# Altium project uMultimeter.PrjPCB
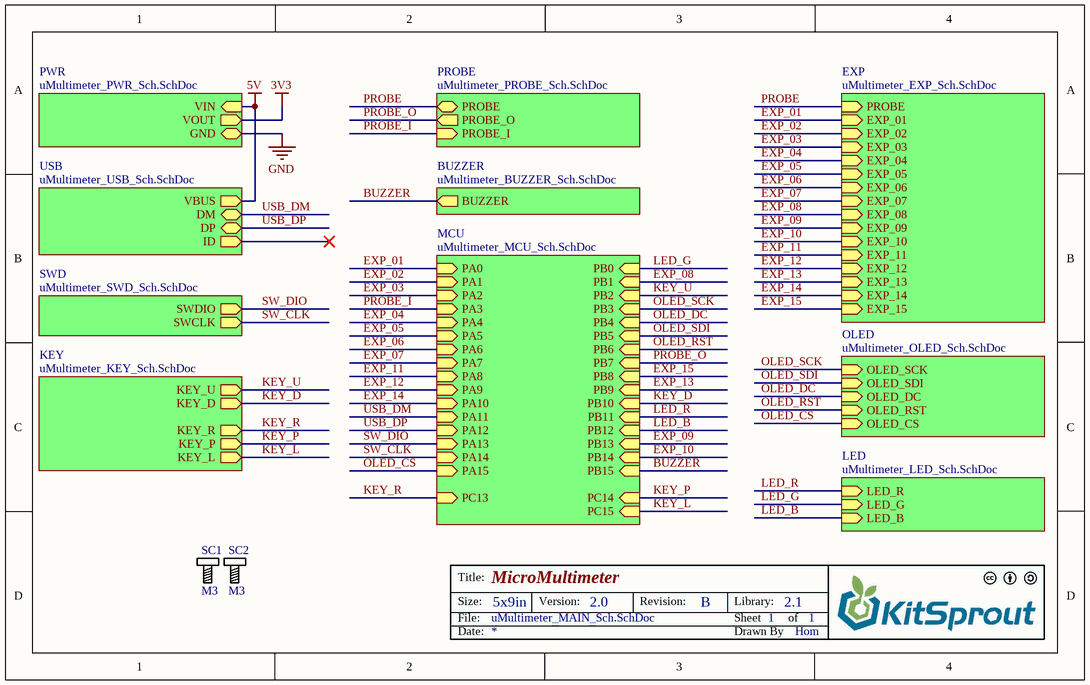
[diagram p0: uMultimeter_MAIN_Sch.SchDoc]
11 sheets, 55 parts. Net scope: hierarchical (ports join the sheet entries above them; power ports are global).
Board file: uMultimeter__Pcb.PcbDoc
Sheets:
  uMultimeter_MAIN_Sch.SchDoc
    PWR = uMultimeter_PWR_Sch.SchDoc
    SWD = uMultimeter_SWD_Sch.SchDoc
    KEY = uMultimeter_KEY_Sch.SchDoc
    USB = uMultimeter_USB_Sch.SchDoc
    LED = uMultimeter_LED_Sch.SchDoc
    PROBE = uMultimeter_PROBE_Sch.SchDoc
    BUZZER = uMultimeter_BUZZER_Sch.SchDoc
    OLED = uMultimeter_OLED_Sch.SchDoc
    EXP = uMultimeter_EXP_Sch.SchDoc
    MCU = uMultimeter_MCU_Sch.SchDoc

## Sheet uMultimeter_MAIN_Sch.SchDoc: MicroMultimeter
size 203 x 127 mm; Author: Hom; CompanyName: KitSprout; DrawnBy: Hom; Engineer: Hom; Organization: KitSprout; Revision: B; SheetNumber: 1; SheetTotal: 1; License: CC BY-SA 4.0; Version: 2.0; LibVersion: 2.1; PageSetup: Record=PageOptions|CenterHorizontal=True|CenterVertical=True|PrintScale=1.00|XCorrection=1.00|YCorrection=1.00|PrintKind=0|BorderSize=5000000|LeftOffset=0|BottomOffset=0|Orientation=2|PaperLength=1000|PaperWidth=1000|Scale=100|PaperSource=7|PrintQuality=-3|MediaType=1|DitherType=10|PrintScaleMode=0|PaperKind=A4|PaperIndex=9

### Parts
SC1  M3  [SCRREW_M3]
SC2  M3  [SCRREW_M3]

### Sub-sheets
BUZZER = uMultimeter_BUZZER_Sch.SchDoc: BUZZER (out)
EXP = uMultimeter_EXP_Sch.SchDoc: PROBE (in), EXP_01 (in), EXP_02 (in), EXP_03 (in), EXP_04 (in), EXP_05 (in), EXP_06 (in), EXP_07 (in), EXP_08 (in), EXP_09 (in), EXP_10 (in), EXP_11 (in), EXP_12 (in), EXP_13 (in), EXP_14 (in), EXP_15 (in)
KEY = uMultimeter_KEY_Sch.SchDoc: KEY_D (out), KEY_U (out), KEY_P (out), KEY_R (out), KEY_L (out)
LED = uMultimeter_LED_Sch.SchDoc: LED_G (in), LED_R (in), LED_B (in)
MCU = uMultimeter_MCU_Sch.SchDoc: PA0 (in), PA1 (in), PA2 (in), PA3 (in), PA4 (in), PA5 (in), PA6 (in), PA7 (in), PA8 (in), PA9 (in), PA10 (in), PA11 (in), PA12 (in), PA13 (in), PA14 (in), PA15 (in), PB0 (in), PB1 (in), PB2 (in), PB3 (in), PB4 (in), PB5 (in), PB6 (in), PB7 (in), PB8 (in), PB9 (in), PB10 (in), PB11 (in), PB12 (in), PB13 (in), PB14 (in), PB15 (in), PC13 (in), PC14 (in), PC15 (in)
OLED = uMultimeter_OLED_Sch.SchDoc: OLED_SDI (in), OLED_SCK (in), OLED_DC (in), OLED_RST (in), OLED_CS (in)
PROBE = uMultimeter_PROBE_Sch.SchDoc: PROBE (bidir), PROBE_I (in), PROBE_O (out)
PWR = uMultimeter_PWR_Sch.SchDoc: VOUT (out), VIN (in), GND (bidir)
SWD = uMultimeter_SWD_Sch.SchDoc: SWDIO (out), SWCLK (out)
USB = uMultimeter_USB_Sch.SchDoc: DM (bidir), VBUS (out), DP (bidir), ID (out)

### Nets
5V: sheet PWR/VIN, sheet USB/VBUS
BUZZER: sheet BUZZER/BUZZER, sheet MCU/PB15
EXP_01: sheet EXP/EXP_01, sheet MCU/PA0
EXP_02: sheet EXP/EXP_02, sheet MCU/PA1
EXP_03: sheet EXP/EXP_03, sheet MCU/PA2
EXP_04: sheet EXP/EXP_04, sheet MCU/PA4
EXP_05: sheet EXP/EXP_05, sheet MCU/PA5
EXP_06: sheet EXP/EXP_06, sheet MCU/PA6
EXP_07: sheet EXP/EXP_07, sheet MCU/PA7
EXP_08: sheet EXP/EXP_08, sheet MCU/PB1
EXP_09: sheet EXP/EXP_09, sheet MCU/PB13
EXP_10: sheet EXP/EXP_10, sheet MCU/PB14
EXP_11: sheet EXP/EXP_11, sheet MCU/PA8
EXP_12: sheet EXP/EXP_12, sheet MCU/PA9
EXP_13: sheet EXP/EXP_13, sheet MCU/PB9
EXP_14: sheet EXP/EXP_14, sheet MCU/PA10
EXP_15: sheet EXP/EXP_15, sheet MCU/PB8
KEY_D: sheet KEY/KEY_D, sheet MCU/PB10
KEY_L: sheet KEY/KEY_L, sheet MCU/PC15
KEY_P: sheet KEY/KEY_P, sheet MCU/PC14
KEY_R: sheet KEY/KEY_R, sheet MCU/PC13
KEY_U: sheet KEY/KEY_U, sheet MCU/PB2
LED_B: sheet LED/LED_B, sheet MCU/PB12
LED_G: sheet LED/LED_G, sheet MCU/PB0
LED_R: sheet LED/LED_R, sheet MCU/PB11
OLED_CS: sheet OLED/OLED_CS, sheet MCU/PA15
OLED_DC: sheet OLED/OLED_DC, sheet MCU/PB4
OLED_RST: sheet OLED/OLED_RST, sheet MCU/PB6
OLED_SCK: sheet OLED/OLED_SCK, sheet MCU/PB3
OLED_SDI: sheet OLED/OLED_SDI, sheet MCU/PB5
PROBE: sheet PROBE/PROBE, sheet EXP/PROBE
PROBE_I: sheet PROBE/PROBE_I, sheet MCU/PA3
PROBE_O: sheet PROBE/PROBE_O, sheet MCU/PB7
SW_CLK: sheet SWD/SWCLK, sheet MCU/PA14
SW_DIO: sheet SWD/SWDIO, sheet MCU/PA13
USB_DM: sheet USB/DM, sheet MCU/PA11
USB_DP: sheet USB/DP, sheet MCU/PA12

### Notes on the sheet
- Title:
- Size:
- Date:
- File:
- 5x9in
- Version:
- Revision:
- Sheet
- Drawn By
- Library:
- of

### Library data of the parts
SC1 SC2 = Screw_M3: Screw

## Sheet uMultimeter_PWR_Sch.SchDoc: MicroMultimeter - PWR
size 127 x 101 mm; Author: Hom; CompanyName: KitSprout; DrawnBy: Hom; Engineer: Hom; Organization: KitSprout; Revision: B; SheetNumber: 1; SheetTotal: 1; License: CC BY-SA 4.0; Version: 2.0; LibVersion: 2.1; PageSetup: Record=PageOptions|CenterHorizontal=True|CenterVertical=True|PrintScale=1.00|XCorrection=1.00|YCorrection=1.00|PrintKind=0|BorderSize=5000000|LeftOffset=0|BottomOffset=0|Orientation=2|PaperLength=1000|PaperWidth=1000|Scale=100|PaperSource=7|PrintQuality=-3|MediaType=1|DitherType=10|PrintScaleMode=0|PaperKind=A4|PaperIndex=9
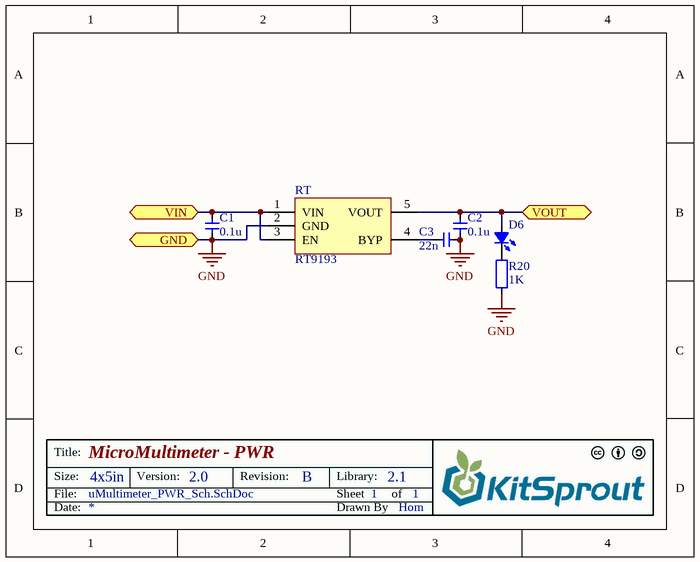
[diagram p1: uMultimeter_PWR_Sch.SchDoc]

### Parts
C1  value 0.1u  [CAP_0603]  (hidden comment: Cap_0603)
C2  value 0.1u  [CAP_0603]  (hidden comment: Cap_0603)
C3  value 22n  [CAP_0603]  (hidden comment: Cap_0603)
D6  LED_0805  [LED_0805_ORANGE]  (value not drawn)
R20  value 1K  [RES_0603]  (hidden comment: Res_0603)
RT  RT9193  [SOT23-5]

### Ports
GND, VIN, VOUT

### Nets
3V3: C2.2 D6.1(A) RT.5(VOUT) ; port VOUT
5V: C1.2 RT.1(VIN) RT.3(EN) ; port VIN
GND: C1.1 C2.1 C3.1 R20.2 RT.2(GND) ; port GND
NetC3_2: C3.2 RT.4(BYP)
NetD6_2: D6.2(K) R20.1

### Notes on the sheet
- Title:
- Size:
- Date:
- File:
- 4x5in
- Version:
- Revision:
- Sheet
- Drawn By
- Library:
- of

### Library data of the parts
C1-C3 = Cap_0603: Capacitor
D6 = LED_0805: LED
R20 = Res_0603: Resistor
RT = SP6205: Power

## Sheet uMultimeter_SWD_Sch.SchDoc: MicroMultimeter - SWD
size 127 x 101 mm; Author: Hom; CompanyName: KitSprout; DrawnBy: Hom; Engineer: Hom; Organization: KitSprout; Revision: B; SheetNumber: 1; SheetTotal: 1; License: CC BY-SA 4.0; Version: 2.0; LibVersion: 2.1; PageSetup: Record=PageOptions|CenterHorizontal=True|CenterVertical=True|PrintScale=1.00|XCorrection=1.00|YCorrection=1.00|PrintKind=0|BorderSize=5000000|LeftOffset=0|BottomOffset=0|Orientation=2|PaperLength=1000|PaperWidth=1000|Scale=100|PaperSource=7|PrintQuality=-3|MediaType=1|DitherType=10|PrintScaleMode=0|PaperKind=A4|PaperIndex=9
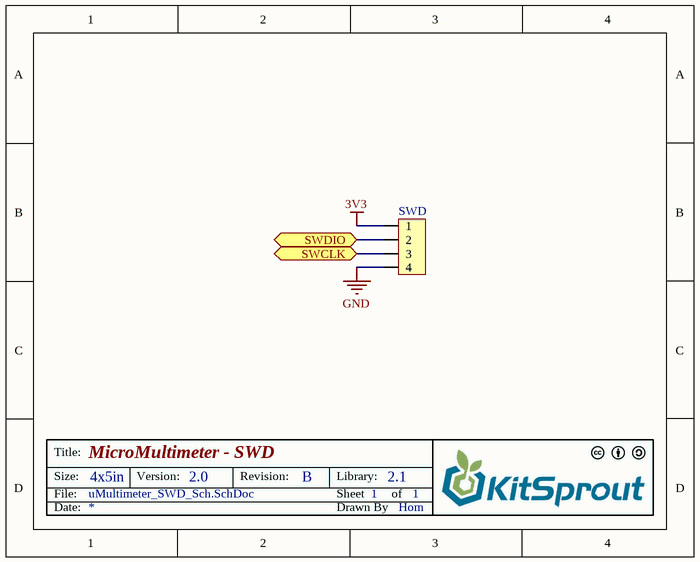
[diagram p2: uMultimeter_SWD_Sch.SchDoc]

### Parts
SWD  HDR1x4_1.27  [HDR1X4_1.27_180]  (value not drawn)

### Ports
SWCLK, SWDIO

### Nets
3V3: SWD.1
GND: SWD.4
SW_CLK: SWD.3 ; port SWCLK
SW_DIO: SWD.2 ; port SWDIO

### Notes on the sheet
- Title:
- Size:
- Date:
- File:
- 4x5in
- Version:
- Revision:
- Sheet
- Drawn By
- Library:
- of

### Library data of the parts
SWD = HDR1x4_1.27: Header

## Sheet uMultimeter_KEY_Sch.SchDoc: MicroMultimeter - KEY
size 127 x 101 mm; Author: Hom; CompanyName: KitSprout; DrawnBy: Hom; Engineer: Hom; Organization: KitSprout; Revision: B; SheetNumber: 1; SheetTotal: 1; License: CC BY-SA 4.0; Version: 2.0; LibVersion: 2.1; PageSetup: Record=PageOptions|CenterHorizontal=True|CenterVertical=True|PrintScale=1.00|XCorrection=1.00|YCorrection=1.00|PrintKind=0|BorderSize=5000000|LeftOffset=0|BottomOffset=0|Orientation=2|PaperLength=1000|PaperWidth=1000|Scale=100|PaperSource=7|PrintQuality=-3|MediaType=1|DitherType=10|PrintScaleMode=0|PaperKind=A4|PaperIndex=9
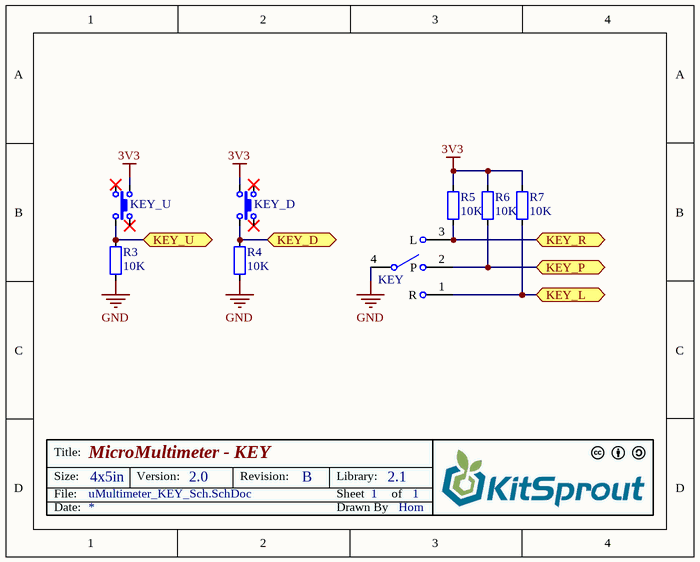
[diagram p3: uMultimeter_KEY_Sch.SchDoc]

### Parts
KEY  ButtonPushLever_11*12_90  [ButtonPushLever_11*12_90]  (value not drawn)
KEY_D  ButtonTACT  [ButtonTACT_3.5*3.55_90]  (value not drawn)
KEY_U  ButtonTACT  [ButtonTACT_3.5*3.55_90]  (value not drawn)
R3  value 10K  [RES_0603]  (hidden comment: Res_0603)
R4  value 10K  [RES_0603]  (hidden comment: Res_0603)
R5  value 10K  [RES_0603]  (hidden comment: Res_0603)
R6  value 10K  [RES_0603]  (hidden comment: Res_0603)
R7  value 10K  [RES_0603]  (hidden comment: Res_0603)

### Ports
KEY_D, KEY_L, KEY_P, KEY_R, KEY_U

### Nets
3V3: KEY_D.3 KEY_U.1 R5.2 R6.2 R7.2
GND: KEY.4 R3.1 R4.1
KEY_D: KEY_D.4 R4.2 ; port KEY_D
KEY_L: KEY.1(R) R7.1 ; port KEY_L
KEY_P: KEY.2(P) R6.1 ; port KEY_P
KEY_R: KEY.3(L) R5.1 ; port KEY_R
KEY_U: KEY_U.4 R3.2 ; port KEY_U

Not connected (* = marked no-connect by the designer): KEY_D 1* 2*; KEY_U 2* 3*

### Notes on the sheet
- Title:
- Size:
- Date:
- File:
- 4x5in
- Version:
- Revision:
- Sheet
- Drawn By
- Library:
- of

### Library data of the parts
KEY = ButtonPushLever_11*12_90: Button
KEY_D KEY_U = ButtonTACT: Button
R3-R7 = Res_0603: Resistor

## Sheet uMultimeter_USB_Sch.SchDoc: MicroMultimeter - USB
size 127 x 101 mm; Author: Hom; CompanyName: KitSprout; DrawnBy: Hom; Engineer: Hom; Organization: KitSprout; Revision: B; SheetNumber: 1; SheetTotal: 1; License: CC BY-SA 4.0; Version: 2.0; LibVersion: 2.1; PageSetup: Record=PageOptions|CenterHorizontal=True|CenterVertical=True|PrintScale=1.00|XCorrection=1.00|YCorrection=1.00|PrintKind=0|BorderSize=5000000|LeftOffset=0|BottomOffset=0|Orientation=2|PaperLength=1000|PaperWidth=1000|Scale=100|PaperSource=7|PrintQuality=-3|MediaType=1|DitherType=10|PrintScaleMode=0|PaperKind=A4|PaperIndex=9
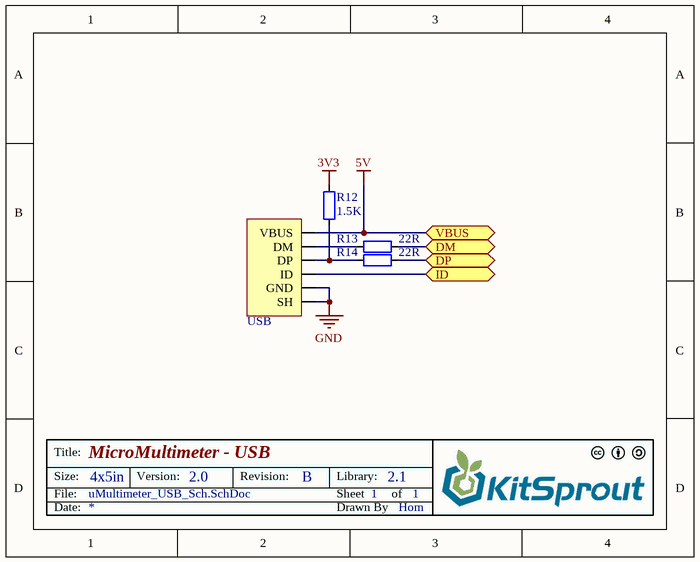
[diagram p4: uMultimeter_USB_Sch.SchDoc]

### Parts
R12  value 1.5K  [RES_0603]  (hidden comment: Res_0603)
R13  value 22R  [RES_0603]  (hidden comment: Res_0603)
R14  value 22R  [RES_0603]  (hidden comment: Res_0603)
USB  USB_Micro  [USB_Micro-AB]  (value not drawn)

### Ports
DM, DP, ID, VBUS

### Nets
3V3: R12.1
5V: USB.1(VBUS) ; port VBUS
GND: USB.0(SH) USB.5(GND)
USB_DM: R13.2 ; port DM
USB_DP: R14.2 ; port DP
NetR12_2: R12.2 R14.1 USB.3(DP)
NetR13_1: R13.1 USB.2(DM)
NetUSB_4: USB.4(ID) ; port ID

### Notes on the sheet
- Title:
- Size:
- Date:
- File:
- 4x5in
- Version:
- Revision:
- Sheet
- Drawn By
- Library:
- of

### Library data of the parts
R12-R14 = Res_0603: Resistor
USB = USB_Micro: USB

## Sheet uMultimeter_LED_Sch.SchDoc: MicroMultimeter - LED
size 127 x 101 mm; Author: Hom; CompanyName: KitSprout; DrawnBy: Hom; Engineer: Hom; Organization: KitSprout; Revision: B; SheetNumber: 1; SheetTotal: 1; License: CC BY-SA 4.0; Version: 2.0; LibVersion: 2.1; PageSetup: Record=PageOptions|CenterHorizontal=True|CenterVertical=True|PrintScale=1.00|XCorrection=1.00|YCorrection=1.00|PrintKind=0|BorderSize=5000000|LeftOffset=0|BottomOffset=0|Orientation=2|PaperLength=1000|PaperWidth=1000|Scale=100|PaperSource=7|PrintQuality=-3|MediaType=1|DitherType=10|PrintScaleMode=0|PaperKind=A4|PaperIndex=9
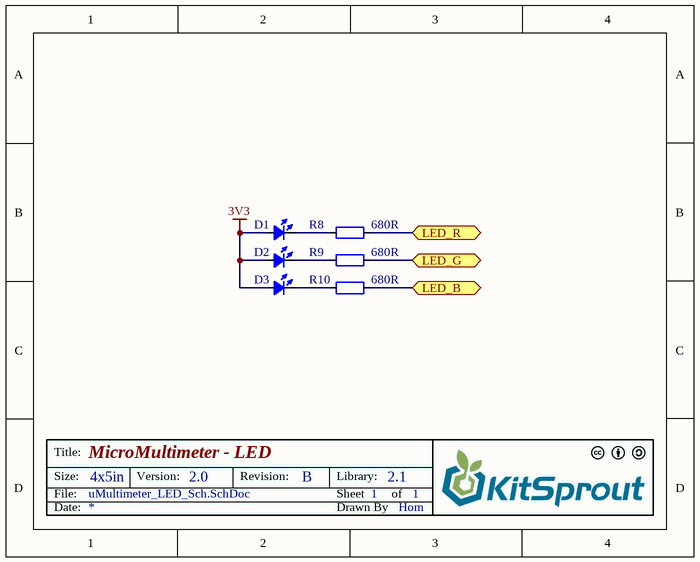
[diagram p5: uMultimeter_LED_Sch.SchDoc]

### Parts
D1  LED_0805  [LED_0805_RED]  (value not drawn)
D2  LED_0805  [LED_0805_GREEN]  (value not drawn)
D3  LED_0805  [LED_0805_BLUE]  (value not drawn)
R8  value 680R  [RES_0603]  (hidden comment: Res_0603)
R9  value 680R  [RES_0603]  (hidden comment: Res_0603)
R10  value 680R  [RES_0603]  (hidden comment: Res_0603)

### Ports
LED_B, LED_G, LED_R

### Nets
3V3: D1.1(A) D2.1(A) D3.1(A)
LED_B: R10.2 ; port LED_B
LED_G: R9.1 ; port LED_G
LED_R: R8.1 ; port LED_R
NetD1_2: D1.2(K) R8.2
NetD2_2: D2.2(K) R9.2
NetD3_2: D3.2(K) R10.1

### Notes on the sheet
- Title:
- Size:
- Date:
- File:
- 4x5in
- Version:
- Revision:
- Sheet
- Drawn By
- Library:
- of

### Library data of the parts
D1-D3 = LED_0805: LED
R8-R10 = Res_0603: Resistor

## Sheet uMultimeter_PROBE_Sch.SchDoc: MicroMultimeter - Probe
size 127 x 101 mm; Author: Hom; CompanyName: KitSprout; DrawnBy: Hom; Engineer: Hom; Organization: KitSprout; Revision: B; SheetNumber: 1; SheetTotal: 1; License: CC BY-SA 4.0; Version: 2.0; LibVersion: 2.1; PageSetup: Record=PageOptions|CenterHorizontal=True|CenterVertical=True|PrintScale=1.00|XCorrection=1.00|YCorrection=1.00|PrintKind=0|BorderSize=5000000|LeftOffset=0|BottomOffset=0|Orientation=2|PaperLength=1000|PaperWidth=1000|Scale=100|PaperSource=7|PrintQuality=-3|MediaType=1|DitherType=10|PrintScaleMode=0|PaperKind=A4|PaperIndex=9
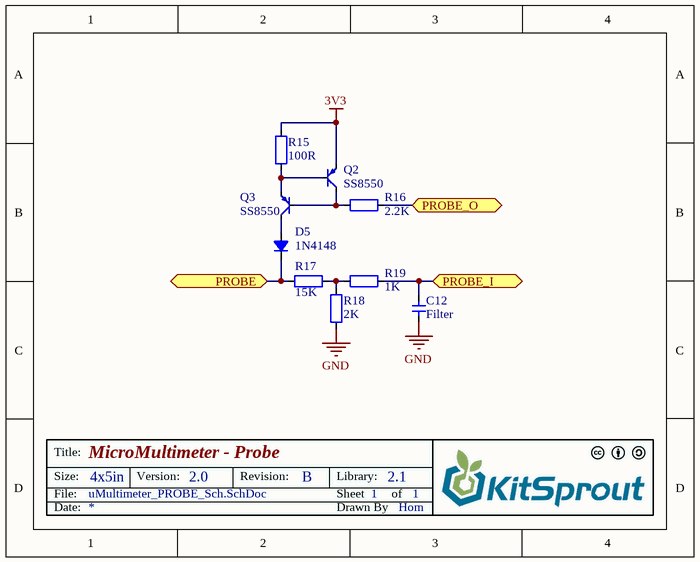
[diagram p6: uMultimeter_PROBE_Sch.SchDoc]

### Parts
C12  value Filter  [CAP_0603]  (hidden comment: Cap_0603)
D5  value 1N4148  [SOD-323]  (hidden comment: Diode_SOD323)
Q2  value SS8550  [SOT23-3]  (hidden comment: BJT_PNP)
Q3  value SS8550  [SOT23-3]  (hidden comment: BJT_PNP)
R15  value 100R  [RES_0603]  (hidden comment: Res_0603)
R16  value 2.2K  [RES_0603]  (hidden comment: Res_0603)
R17  value 15K  [RES_0603]  (hidden comment: Res_0603)
R18  value 2K  [RES_0603]  (hidden comment: Res_0603)
R19  value 1K  [RES_0603]  (hidden comment: Res_0603)

### Ports
PROBE, PROBE_I, PROBE_O

### Nets
3V3: Q2.2(E) R15.2
GND: C12.1 R18.2
PROBE: D5.2(K) R17.2 ; port PROBE
PROBE_I: C12.2 R19.2 ; port PROBE_I
PROBE_O: R16.1 ; port PROBE_O
NetD5_1: D5.1(A) Q3.3(C)
NetQ2_1: Q2.1(B) Q3.2(E) R15.1
NetQ2_3: Q2.3(C) Q3.1(B) R16.2
NetR17_1: R17.1 R18.1 R19.1

### Notes on the sheet
- Title:
- Size:
- Date:
- File:
- 4x5in
- Version:
- Revision:
- Sheet
- Drawn By
- Library:
- of

### Library data of the parts
C12 = Cap_0603: Capacitor
D5 = Diode_SOD323: Diode
Q2 Q3 = BJT_PNP: Transistor
R15-R19 = Res_0603: Resistor

## Sheet uMultimeter_BUZZER_Sch.SchDoc: MicroMultimeter - Buzzer
size 127 x 101 mm; Author: Hom; CompanyName: KitSprout; DrawnBy: Hom; Engineer: Hom; Organization: KitSprout; Revision: B; SheetNumber: 1; SheetTotal: 1; License: CC BY-SA 4.0; Version: 2.0; LibVersion: 2.1; PageSetup: Record=PageOptions|CenterHorizontal=True|CenterVertical=True|PrintScale=1.00|XCorrection=1.00|YCorrection=1.00|PrintKind=0|BorderSize=5000000|LeftOffset=0|BottomOffset=0|Orientation=2|PaperLength=1000|PaperWidth=1000|Scale=100|PaperSource=7|PrintQuality=-3|MediaType=1|DitherType=10|PrintScaleMode=0|PaperKind=A4|PaperIndex=9
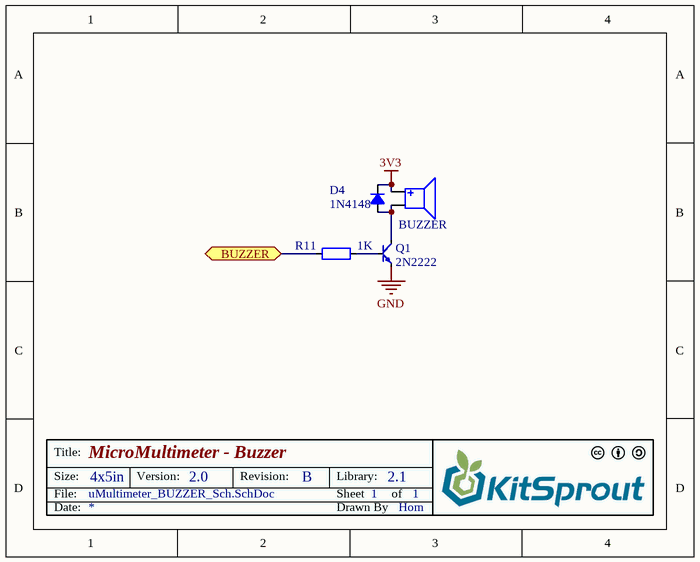
[diagram p7: uMultimeter_BUZZER_Sch.SchDoc]

### Parts
BUZZER  Buzzer  [Buzzer_5x5]  (value not drawn)
D4  value 1N4148  [SOD-323]  (hidden comment: Diode_SOD323)
Q1  value 2N2222  [SOT23-3]  (hidden comment: BJT_NPN)
R11  value 1K  [RES_0603]  (hidden comment: Res_0603)

### Ports
BUZZER

### Nets
3V3: BUZZER.P(Positive) D4.2(K)
GND: Q1.2(E)
BUZZER: R11.2 ; port BUZZER
NetBUZZER_N: BUZZER.N(Negative) D4.1(A) Q1.3(C)
NetQ1_1: Q1.1(B) R11.1

### Notes on the sheet
- Title:
- Size:
- Date:
- File:
- 4x5in
- Version:
- Revision:
- Sheet
- Drawn By
- Library:
- of

### Library data of the parts
D4 = Diode_SOD323: Diode
Q1 = BJT_NPN: Transistor
R11 = Res_0603: Resistor

## Sheet uMultimeter_OLED_Sch.SchDoc: MicroMultimeter - OLED
size 127 x 101 mm; Author: Hom; CompanyName: KitSprout; DrawnBy: Hom; Engineer: Hom; Organization: KitSprout; Revision: B; SheetNumber: 1; SheetTotal: 1; License: CC BY-SA 4.0; Version: 2.0; LibVersion: 2.1; PageSetup: Record=PageOptions|CenterHorizontal=True|CenterVertical=True|PrintScale=1.00|XCorrection=1.00|YCorrection=1.00|PrintKind=0|BorderSize=5000000|LeftOffset=0|BottomOffset=0|Orientation=2|PaperLength=1000|PaperWidth=1000|Scale=100|PaperSource=7|PrintQuality=-3|MediaType=1|DitherType=10|PrintScaleMode=0|PaperKind=A4|PaperIndex=9
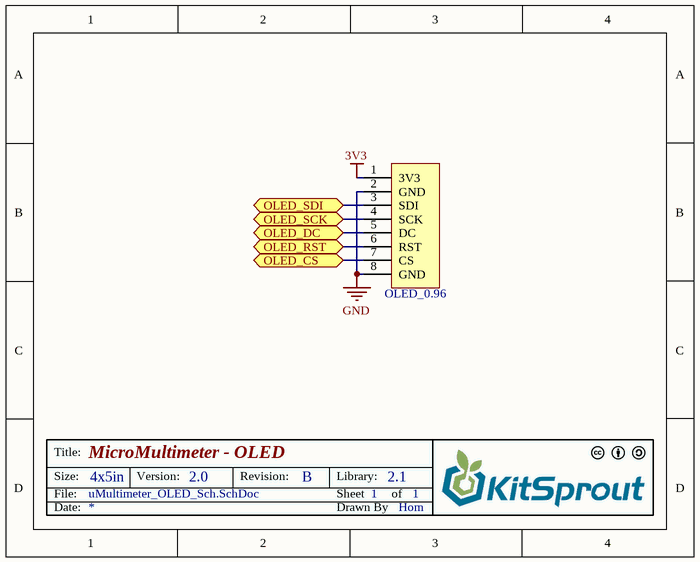
[diagram p8: uMultimeter_OLED_Sch.SchDoc]

### Parts
OLED_0.96  OLED_0.96  [OLED_0.96_96x64_v2]  (value not drawn)

### Ports
OLED_CS, OLED_DC, OLED_RST, OLED_SCK, OLED_SDI

### Nets
3V3: OLED_0.96.1(3V3)
GND: OLED_0.96.2(GND) OLED_0.96.8(GND)
OLED_CS: OLED_0.96.7(CS) ; port OLED_CS
OLED_DC: OLED_0.96.5(DC) ; port OLED_DC
OLED_RST: OLED_0.96.6(RST) ; port OLED_RST
OLED_SCK: OLED_0.96.4(SCK) ; port OLED_SCK
OLED_SDI: OLED_0.96.3(SDI) ; port OLED_SDI

### Notes on the sheet
- Title:
- Size:
- Date:
- File:
- 4x5in
- Version:
- Revision:
- Sheet
- Drawn By
- Library:
- of

### Library data of the parts
OLED_0.96 = OLED_0.96_96*64_v2: Module

## Sheet uMultimeter_EXP_Sch.SchDoc: MicroMultimeter - EXP
size 127 x 101 mm; Author: Hom; CompanyName: KitSprout; DrawnBy: Hom; Engineer: Hom; Organization: KitSprout; Revision: B; SheetNumber: 1; SheetTotal: 1; License: CC BY-SA 4.0; Version: 2.0; LibVersion: 2.1; PageSetup: Record=PageOptions|CenterHorizontal=True|CenterVertical=True|PrintScale=1.00|XCorrection=1.00|YCorrection=1.00|PrintKind=0|BorderSize=5000000|LeftOffset=0|BottomOffset=0|Orientation=2|PaperLength=1000|PaperWidth=1000|Scale=100|PaperSource=7|PrintQuality=-3|MediaType=1|DitherType=10|PrintScaleMode=0|PaperKind=A4|PaperIndex=9
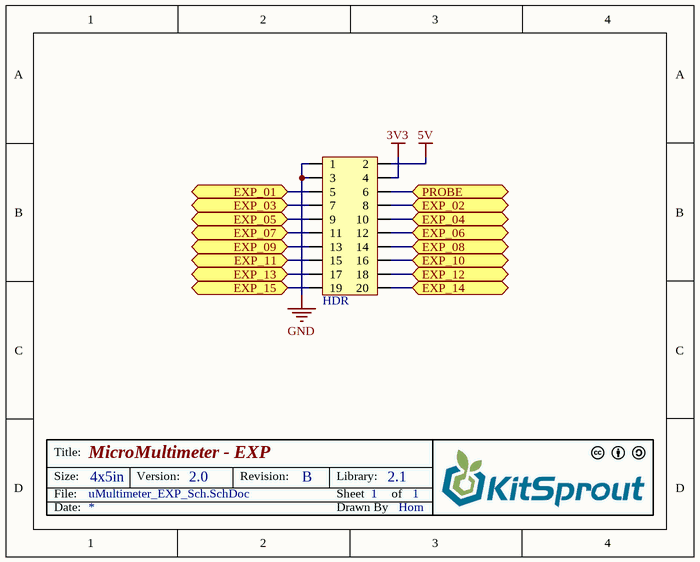
[diagram p9: uMultimeter_EXP_Sch.SchDoc]

### Parts
HDR  HDR2x10_2.54  [HDR2X10_2.54_180HF]  (value not drawn)

### Ports
EXP_01, EXP_02, EXP_03, EXP_04, EXP_05, EXP_06, EXP_07, EXP_08, EXP_09, EXP_10, EXP_11, EXP_12, EXP_13, EXP_14, EXP_15, PROBE

### Nets
3V3: HDR.4
5V: HDR.2
GND: HDR.1 HDR.3
EXP_01: HDR.5 ; port EXP_01
EXP_02: HDR.8 ; port EXP_02
EXP_03: HDR.7 ; port EXP_03
EXP_04: HDR.10 ; port EXP_04
EXP_05: HDR.9 ; port EXP_05
EXP_06: HDR.12 ; port EXP_06
EXP_07: HDR.11 ; port EXP_07
EXP_08: HDR.14 ; port EXP_08
EXP_09: HDR.13 ; port EXP_09
EXP_10: HDR.16 ; port EXP_10
EXP_11: HDR.15 ; port EXP_11
EXP_12: HDR.18 ; port EXP_12
EXP_13: HDR.17 ; port EXP_13
EXP_14: HDR.20 ; port EXP_14
EXP_15: HDR.19 ; port EXP_15
PROBE: HDR.6 ; port PROBE

### Notes on the sheet
- Title:
- Size:
- Date:
- File:
- 4x5in
- Version:
- Revision:
- Sheet
- Drawn By
- Library:
- of

### Library data of the parts
HDR = HDR2x10_2.54: Header

## Sheet uMultimeter_MCU_Sch.SchDoc: MicroMultimeter - MCU
size 127 x 127 mm; Author: Hom; CompanyName: KitSprout; DrawnBy: Hom; Engineer: Hom; Organization: KitSprout; Revision: B; SheetNumber: 1; SheetTotal: 1; License: CC BY-SA 4.0; Version: 2.0; LibVersion: 2.1; PageSetup: Record=PageOptions|CenterHorizontal=True|CenterVertical=True|PrintScale=1.00|XCorrection=1.00|YCorrection=1.00|PrintKind=0|BorderSize=5000000|LeftOffset=0|BottomOffset=0|Orientation=2|PaperLength=1000|PaperWidth=1000|Scale=100|PaperSource=7|PrintQuality=-3|MediaType=1|DitherType=10|PrintScaleMode=0|PaperKind=A4|PaperIndex=9
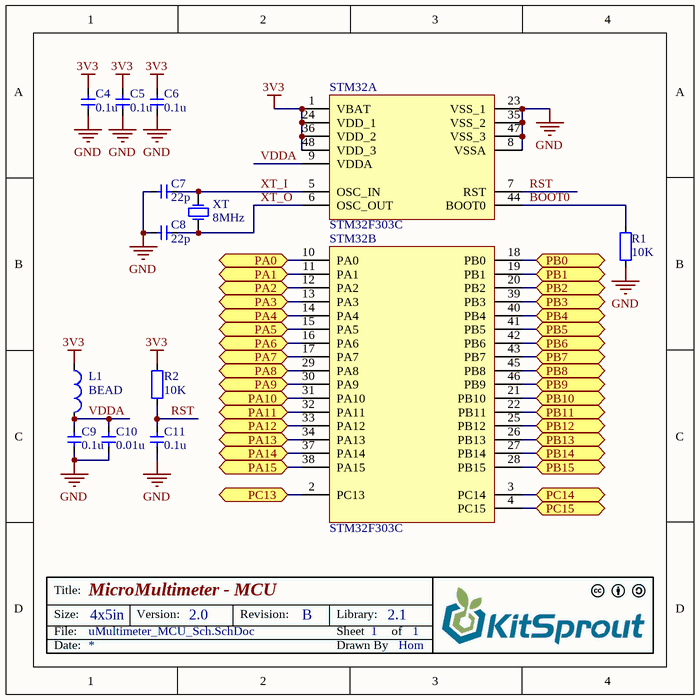
[diagram p10: uMultimeter_MCU_Sch.SchDoc]

### Parts
C4  value 0.1u  [CAP_0603]  (hidden comment: Cap_0603)
C5  value 0.1u  [CAP_0603]  (hidden comment: Cap_0603)
C6  value 0.1u  [CAP_0603]  (hidden comment: Cap_0603)
C7  value 22p  [CAP_0603]  (hidden comment: Cap_0603)
C8  value 22p  [CAP_0603]  (hidden comment: Cap_0603)
C9  value 0.1u  [CAP_0603]  (hidden comment: Cap_0603)
C10  value 0.01u  [CAP_0603]  (hidden comment: Cap_0603)
C11  value 0.1u  [CAP_0603]  (hidden comment: Cap_0603)
L1  value BEAD  [IND_0603]  (hidden comment: Ind_0603)
R1  value 10K  [RES_0603]  (hidden comment: Res_0603)
R2  value 10K  [RES_0603]  (hidden comment: Res_0603)
STM32  STM32F303C  [LQFP_P0.5_48]  (parts A,B of 2)
XT  value 8MHz  [XT_5032_2]  (hidden comment: XTAL_5032_2P)

### Ports
PA0, PA1, PA2, PA3, PA4, PA5, PA6, PA7, PA8, PA9, PA10, PA11, PA12, PA13, PA14, PA15, PB0, PB1, PB2, PB3, PB4, PB5, PB6, PB7, PB8, PB9, PB10, PB11, PB12, PB13, PB14, PB15, PC13, PC14, PC15

### Nets
3V3: C4.2 C5.2 C6.2 L1.1 R2.2 STM32.1(VBAT) STM32.24(VDD_1) STM32.36(VDD_2) STM32.48(VDD_3)
GND: C4.1 C5.1 C6.1 C7.2 C8.2 C9.1 C10.1 C11.1 R1.1 STM32.8(VSSA) STM32.23(VSS_1) STM32.35(VSS_2) STM32.47(VSS_3)
BOOT0: R1.2 STM32.44(BOOT0)
BUZZER: STM32.28(PB15) ; port PB15
EXP_01: STM32.10(PA0) ; port PA0
EXP_02: STM32.11(PA1) ; port PA1
EXP_03: STM32.12(PA2) ; port PA2
EXP_04: STM32.14(PA4) ; port PA4
EXP_05: STM32.15(PA5) ; port PA5
EXP_06: STM32.16(PA6) ; port PA6
EXP_07: STM32.17(PA7) ; port PA7
EXP_08: STM32.19(PB1) ; port PB1
EXP_09: STM32.26(PB13) ; port PB13
EXP_10: STM32.27(PB14) ; port PB14
EXP_11: STM32.29(PA8) ; port PA8
EXP_12: STM32.30(PA9) ; port PA9
EXP_13: STM32.46(PB9) ; port PB9
EXP_14: STM32.31(PA10) ; port PA10
EXP_15: STM32.45(PB8) ; port PB8
KEY_D: STM32.21(PB10) ; port PB10
KEY_L: STM32.4(PC15) ; port PC15
KEY_P: STM32.3(PC14) ; port PC14
KEY_R: STM32.2(PC13) ; port PC13
KEY_U: STM32.20(PB2) ; port PB2
LED_B: STM32.25(PB12) ; port PB12
LED_G: STM32.18(PB0) ; port PB0
LED_R: STM32.22(PB11) ; port PB11
OLED_CS: STM32.38(PA15) ; port PA15
OLED_DC: STM32.40(PB4) ; port PB4
OLED_RST: STM32.42(PB6) ; port PB6
OLED_SCK: STM32.39(PB3) ; port PB3
OLED_SDI: STM32.41(PB5) ; port PB5
PROBE_I: STM32.13(PA3) ; port PA3
PROBE_O: STM32.43(PB7) ; port PB7
RST: C11.2 R2.1 STM32.7(RST)
SW_CLK: STM32.37(PA14) ; port PA14
SW_DIO: STM32.34(PA13) ; port PA13
USB_DM: STM32.32(PA11) ; port PA11
USB_DP: STM32.33(PA12) ; port PA12
VDDA: C9.2 C10.2 L1.2 STM32.9(VDDA)
XT_I: C7.1 STM32.5(OSC_IN) XT.2(OSC2)
XT_O: C8.1 STM32.6(OSC_OUT) XT.1(OSC1)

### Notes on the sheet
- Title:
- Size:
- Date:
- File:
- 4x5in
- Version:
- Revision:
- Sheet
- Drawn By
- Library:
- of

### Library data of the parts
C4-C11 = Cap_0603: Capacitor
L1 = Ind_0603: Inductor
R1 R2 = Res_0603: Resistor
STM32 = STM32F303C: MCU
XT = XTAL_5032_2P: Crystal Oscillator

## Nets that join several sheets
3V3: uMultimeter_PWR_Sch (C2.2 D6.1 RT.5), uMultimeter_SWD_Sch (SWD.1), uMultimeter_KEY_Sch (5 pins), uMultimeter_USB_Sch (R12.1), uMultimeter_LED_Sch (D1.1 D2.1 D3.1), uMultimeter_PROBE_Sch (Q2.2 R15.2), uMultimeter_BUZZER_Sch (BUZZER.P D4.2), uMultimeter_OLED_Sch (OLED_0.96.1), uMultimeter_EXP_Sch (HDR.4), uMultimeter_MCU_Sch (9 pins)
5V: uMultimeter_PWR_Sch (C1.2 RT.1 RT.3), uMultimeter_USB_Sch (USB.1), uMultimeter_EXP_Sch (HDR.2)
GND: uMultimeter_PWR_Sch (5 pins), uMultimeter_SWD_Sch (SWD.4), uMultimeter_KEY_Sch (KEY.4 R3.1 R4.1), uMultimeter_USB_Sch (USB.0 USB.5), uMultimeter_PROBE_Sch (C12.1 R18.2), uMultimeter_BUZZER_Sch (Q1.2), uMultimeter_OLED_Sch (OLED_0.96.2 OLED_0.96.8), uMultimeter_EXP_Sch (HDR.1 HDR.3), uMultimeter_MCU_Sch (13 pins)
BUZZER: uMultimeter_BUZZER_Sch (R11.2), uMultimeter_MCU_Sch (STM32.28)
EXP_01: uMultimeter_EXP_Sch (HDR.5), uMultimeter_MCU_Sch (STM32.10)
EXP_02: uMultimeter_EXP_Sch (HDR.8), uMultimeter_MCU_Sch (STM32.11)
EXP_03: uMultimeter_EXP_Sch (HDR.7), uMultimeter_MCU_Sch (STM32.12)
EXP_04: uMultimeter_EXP_Sch (HDR.10), uMultimeter_MCU_Sch (STM32.14)
EXP_05: uMultimeter_EXP_Sch (HDR.9), uMultimeter_MCU_Sch (STM32.15)
EXP_06: uMultimeter_EXP_Sch (HDR.12), uMultimeter_MCU_Sch (STM32.16)
EXP_07: uMultimeter_EXP_Sch (HDR.11), uMultimeter_MCU_Sch (STM32.17)
EXP_08: uMultimeter_EXP_Sch (HDR.14), uMultimeter_MCU_Sch (STM32.19)
EXP_09: uMultimeter_EXP_Sch (HDR.13), uMultimeter_MCU_Sch (STM32.26)
EXP_10: uMultimeter_EXP_Sch (HDR.16), uMultimeter_MCU_Sch (STM32.27)
EXP_11: uMultimeter_EXP_Sch (HDR.15), uMultimeter_MCU_Sch (STM32.29)
EXP_12: uMultimeter_EXP_Sch (HDR.18), uMultimeter_MCU_Sch (STM32.30)
EXP_13: uMultimeter_EXP_Sch (HDR.17), uMultimeter_MCU_Sch (STM32.46)
EXP_14: uMultimeter_EXP_Sch (HDR.20), uMultimeter_MCU_Sch (STM32.31)
EXP_15: uMultimeter_EXP_Sch (HDR.19), uMultimeter_MCU_Sch (STM32.45)
KEY_D: uMultimeter_KEY_Sch (KEY_D.4 R4.2), uMultimeter_MCU_Sch (STM32.21)
KEY_L: uMultimeter_KEY_Sch (KEY.1 R7.1), uMultimeter_MCU_Sch (STM32.4)
KEY_P: uMultimeter_KEY_Sch (KEY.2 R6.1), uMultimeter_MCU_Sch (STM32.3)
KEY_R: uMultimeter_KEY_Sch (KEY.3 R5.1), uMultimeter_MCU_Sch (STM32.2)
KEY_U: uMultimeter_KEY_Sch (KEY_U.4 R3.2), uMultimeter_MCU_Sch (STM32.20)
LED_B: uMultimeter_LED_Sch (R10.2), uMultimeter_MCU_Sch (STM32.25)
LED_G: uMultimeter_LED_Sch (R9.1), uMultimeter_MCU_Sch (STM32.18)
LED_R: uMultimeter_LED_Sch (R8.1), uMultimeter_MCU_Sch (STM32.22)
OLED_CS: uMultimeter_OLED_Sch (OLED_0.96.7), uMultimeter_MCU_Sch (STM32.38)
OLED_DC: uMultimeter_OLED_Sch (OLED_0.96.5), uMultimeter_MCU_Sch (STM32.40)
OLED_RST: uMultimeter_OLED_Sch (OLED_0.96.6), uMultimeter_MCU_Sch (STM32.42)
OLED_SCK: uMultimeter_OLED_Sch (OLED_0.96.4), uMultimeter_MCU_Sch (STM32.39)
OLED_SDI: uMultimeter_OLED_Sch (OLED_0.96.3), uMultimeter_MCU_Sch (STM32.41)
PROBE: uMultimeter_PROBE_Sch (D5.2 R17.2), uMultimeter_EXP_Sch (HDR.6)
PROBE_I: uMultimeter_PROBE_Sch (C12.2 R19.2), uMultimeter_MCU_Sch (STM32.13)
PROBE_O: uMultimeter_PROBE_Sch (R16.1), uMultimeter_MCU_Sch (STM32.43)
SW_CLK: uMultimeter_SWD_Sch (SWD.3), uMultimeter_MCU_Sch (STM32.37)
SW_DIO: uMultimeter_SWD_Sch (SWD.2), uMultimeter_MCU_Sch (STM32.34)
USB_DM: uMultimeter_USB_Sch (R13.2), uMultimeter_MCU_Sch (STM32.32)
USB_DP: uMultimeter_USB_Sch (R14.2), uMultimeter_MCU_Sch (STM32.33)